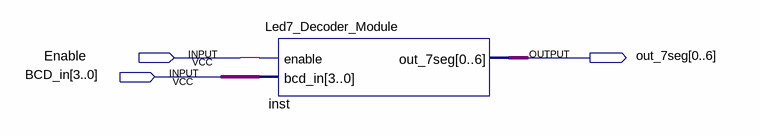
[diagram p0: schematic sheet]
// Quartus schematic Led7_Decoder.bdf as structural Verilog: 1 symbols, 3 pins
module Led7_Decoder (
  input  Enable,
  input  [3:0] BCD_in,
  output [0:6] out_7seg
);

  Led7_Decoder_Module inst (.enable(Enable), .bcd_in(BCD_in), .out_7seg(out_7seg));
endmodule
